# Altium schematic sheet LP5907MFX-3.3NPB.SchDoc: PVDD
size A4; Date: 08.04.2017; Author: Jan Petrik; CompanyName: FreeDSP; DrawnBy: Jan Petrik; Organization: FreeDSP; DocumentNumber: 6; Revision: B2; SheetNumber: 6; SheetTotal: 16; email: jan_petrik@centrum.cz; license: CC BY-NC 4.0
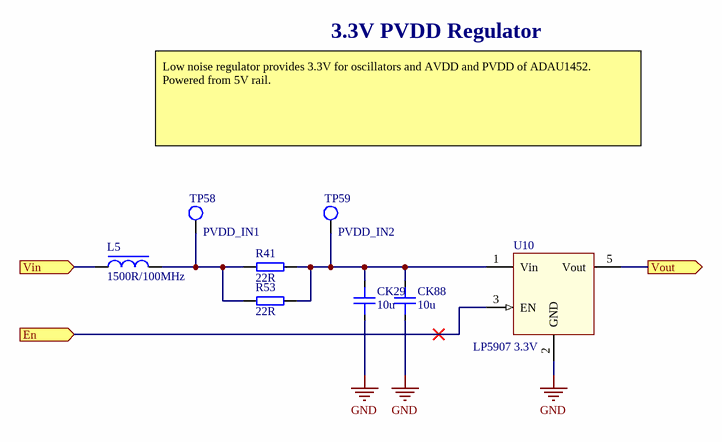
[diagram p0: LP5907MFX-3.3NPB.SchDoc]

## Parts
CK29  10u  [CAPC3216X12N(SMC1206)]
CK88  10u  [CAPC3216X12N(SMC1206)]
L5  1500R/100MHz  [INDC2012X08N(SML0805)]
R41  22R  [RESC1608X06N(SMR0603)]
R53  22R  [RESC1608X06N(SMR0603)]
TP58  PVDD_IN1  [TP_0.8/0.4_ROUND]  (no BOM)
TP59  PVDD_IN2  [TP_0.8/0.4_ROUND]  (no BOM)
U10  LP5907 3.3V  [SOT95P280X90-5N(SOT23-5)]

## Ports
En (in), Vin (in), Vout (out)

## Nets
GND: CK29.2 CK88.2 U10.2(GND)
En: U10.3(EN) ; port En
Vin: L5.1 ; port Vin
Vout: U10.5(Vout) ; port Vout
NetCK29_1: CK29.1 CK88.1 R41.1 R53.1 TP59.1 U10.1(Vin)
NetL5_2: L5.2 R41.2 R53.2 TP58.1

## Notes on the sheet
- 3.3V PVDD Regulator
- Low noise regulator provides 3.3V for oscillators and AVDD and PVDD of ADAU1452.
  Powered from 5V rail.
- Designed by:
- Sheet Title:
- Board Revision:
- License:
- Email:
- www.freedsp.cc
- www.pidsp.com
- Date:
- Sheet:
- /

## Library data of the parts
CK29 CK88 = 10u-50V-1206-X5R: MLCC; Signal Integrity: Cap; Tolerance: 10%; Voltage: 50; Mfgr. PN: GRM31CR61H106MA2L; Mfgr.: Murata; Value: 10u; Package: SMC1206; Simulation: Cap; Author: JP/10.06.2014; Supplier 1: Mouser; Supplier Part Number 1: 81-GRM31CR61H106MA2L
L5 = MMZ2012Y152B: Multilayer SMD Ferrite 1500R/100MHz; Tolerance & Rating: 25%, 100mA/0.55Ohm RDC; Value: 1500R/100MHz; Author: JP/05.06.2014; SMD: 1; Supplier 1: Mouser; Supplier Part Number 1: 810-MMZ2012Y152B
R41 R53 = 22R-100mW-0603-ThickFilm: Chip Resistor; Tolerance & Rating: 1%/0.1W; Signal Integrity: Res; Packare: SMR0603; Value: 22R; Simulation: Res; Author: JP/10.06.2014; SMD: 1; Supplier 1: Mouser; Supplier Part Number 1: 603-RC0603FR-0722RL; Type: Resistor
TP58 TP59 = TEST_POINT_VIA: Testpoint - VIA; Value: 0.65/1.55; SMD: -; ClassName: TP
U10 = LP5907MFX-3.3NPB: Ultra  Low-Noise,  250-mA  Linear  Regulator; SMD: 1; Supplier 1: Mouser; Supplier 2: Digi-Key; Supplier Part Number 1: 595-LP5907MFX-3.3NPB; Supplier Part Number 2: 296-38557-1-ND